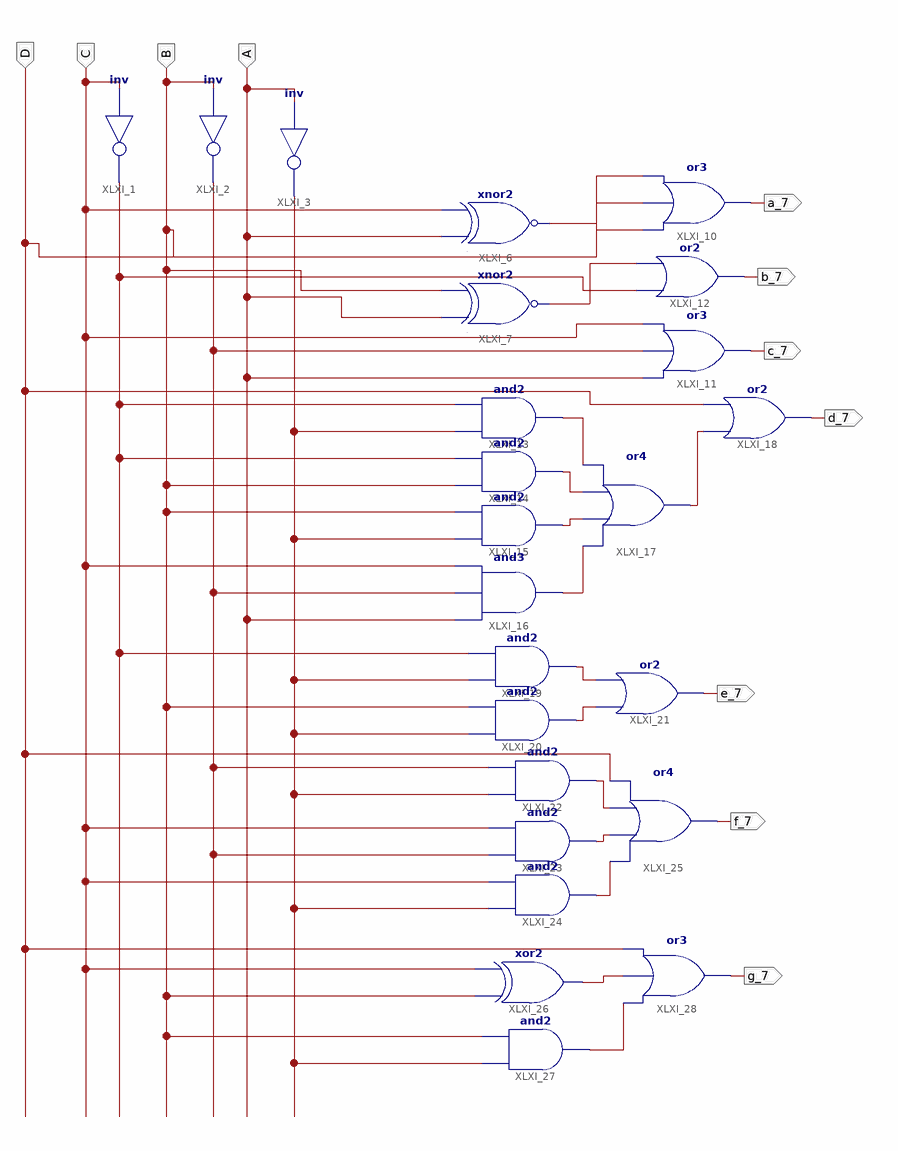
[diagram p0: schematic sheet 1]
// Xilinx ISE schematic Decodificador_4bits.sch (spartan3) as structural Verilog: 24 symbols, 11 ports
module Decodificador_4bits (
  input  B,
  input  C,
  input  D,
  input  A,
  output a_7,
  output b_7,
  output c_7,
  output d_7,
  output e_7,
  output f_7,
  output g_7
);

  wire XLXN_32, XLXN_33, XLXN_34, XLXN_36, XLXN_37, XLXN_40, XLXN_41, XLXN_42, XLXN_43, XLXN_52, XLXN_56,
       XLXN_57, XLXN_59, XLXN_60, XLXN_61, XLXN_71, XLXN_72;

  not XLXI_1 (XLXN_32, C);
  not XLXI_2 (XLXN_33, B);
  not XLXI_3 (XLXN_34, A);
  xnor XLXI_6 (XLXN_36, A, C);
  xnor XLXI_7 (XLXN_37, A, B);
  or XLXI_10 (a_7, B, D, XLXN_36);
  or XLXI_11 (c_7, A, XLXN_33, C);
  or XLXI_12 (b_7, XLXN_32, XLXN_37);
  and XLXI_13 (XLXN_40, XLXN_34, XLXN_32);
  and XLXI_14 (XLXN_41, B, XLXN_32);
  and XLXI_15 (XLXN_42, XLXN_34, B);
  and XLXI_16 (XLXN_43, A, XLXN_33, C);
  or XLXI_17 (XLXN_52, XLXN_43, XLXN_42, XLXN_41, XLXN_40);
  or XLXI_18 (d_7, XLXN_52, D);
  and XLXI_19 (XLXN_57, XLXN_34, XLXN_32);
  and XLXI_20 (XLXN_56, XLXN_34, B);
  or XLXI_21 (e_7, XLXN_56, XLXN_57);
  and XLXI_22 (XLXN_61, XLXN_34, XLXN_33);
  and XLXI_23 (XLXN_60, XLXN_33, C);
  and XLXI_24 (XLXN_59, XLXN_34, C);
  or XLXI_25 (f_7, XLXN_59, XLXN_60, XLXN_61, D);
  xor XLXI_26 (XLXN_72, B, C);
  and XLXI_27 (XLXN_71, XLXN_34, B);
  or XLXI_28 (g_7, XLXN_71, XLXN_72, D);
endmodule
